# Altium schematic sheet master.SchDoc
size A4
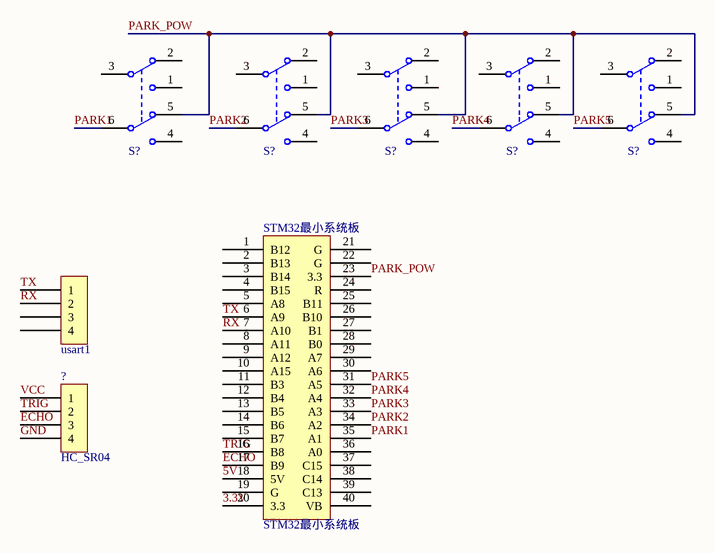
[diagram p0: master.SchDoc]

## Parts
(Parts that share a designator on the sheet are numbered #1, #2 ... from top to bottom, then left to right.)
?#1  usart1  [PCBComponent_1]
?#2  HC_SR04  [PCBComponent_1]
S?#1  7*7自锁开关  [7*7自锁开关]  (value not drawn)
S?#2  7*7自锁开关  [7*7自锁开关]  (value not drawn)
S?#3  7*7自锁开关  [7*7自锁开关]  (value not drawn)
S?#4  7*7自锁开关  [7*7自锁开关]  (value not drawn)
S?#5  7*7自锁开关  [7*7自锁开关]  (value not drawn)
STM32最小系统板  STM32最小系统板  [STM32最小系统板]

## Nets
3.3V: STM32最小系统板.20(3.3)
5V: STM32最小系统板.18(5V)
ECHO: ?#2.?3(3) STM32最小系统板.17(B9)
GND: ?#2.?4(4)
PARK1: S?#1.6(COMMON2) STM32最小系统板.35(A1)
PARK2: S?#2.6(COMMON2) STM32最小系统板.34(A2)
PARK3: S?#3.6(COMMON2) STM32最小系统板.33(A3)
PARK4: S?#4.6(COMMON2) STM32最小系统板.32(A4)
PARK5: S?#5.6(COMMON2) STM32最小系统板.31(A5)
PARK_POW: S?#1.5(NC2) S?#2.5(NC2) S?#3.5(NC2) S?#4.5(NC2) S?#5.5(NC2) STM32最小系统板.23(3.3)
RX: ?#1.?2(2) STM32最小系统板.7(A10)
TRIG: ?#2.?2(2) STM32最小系统板.16(B8)
TX: ?#1.?1(1) STM32最小系统板.6(A9)
VCC: ?#2.?1(1)

Not connected (* = marked no-connect by the designer): ?#1 ?3(3) ?4(4); S?#1 1(NO1) 2(NC1) 3(COMMON1) 4(NO2); S?#2 1(NO1) 2(NC1) 3(COMMON1) 4(NO2); S?#3 1(NO1) 2(NC1) 3(COMMON1) 4(NO2); S?#4 1(NO1) 2(NC1) 3(COMMON1) 4(NO2); S?#5 1(NO1) 2(NC1) 3(COMMON1) 4(NO2); STM32最小系统板 1(B12) 2(B13) 3(B14) 4(B15) 5(A8) 8(A11) 9(A12) 10(A15) 11(B3) 12(B4) 13(B5) 14(B6) 15(B7) 19(G) 21(G) 22(G) 24(R) 25(B11) 26(B10) 27(B1) 28(B0) 29(A7) 30(A6) 36(A0) 37(C15) 38(C14) 39(C13) 40(VB)

## Library data of the parts
?#1 ?#2 = Component_1